# Altium project PCB_Project.PrjPcb
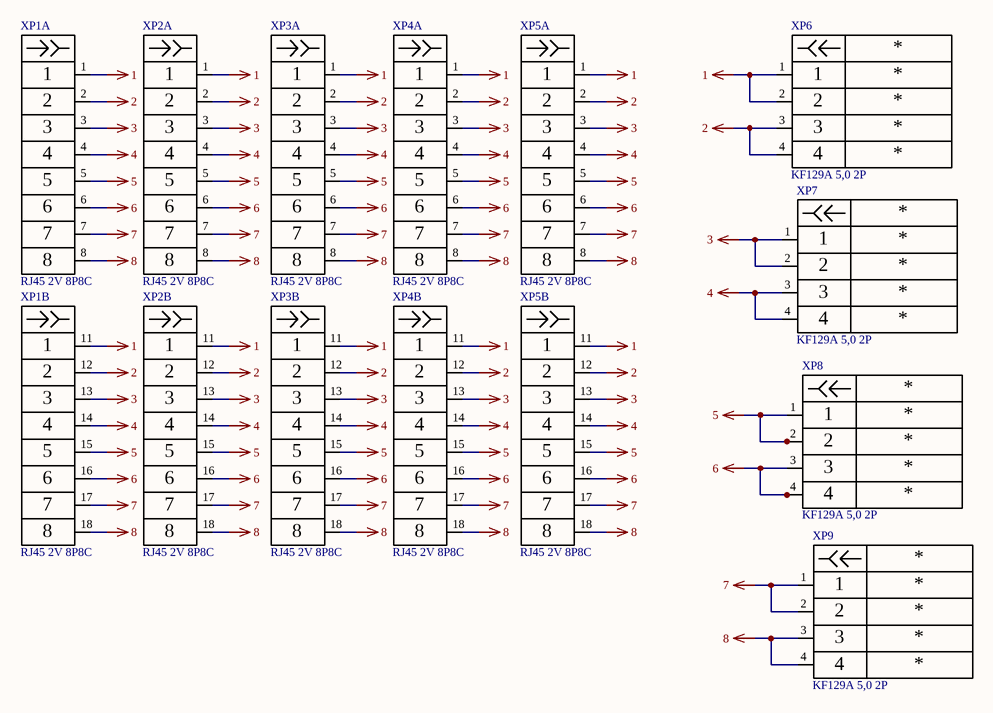
[diagram p0: Sheet3.SchDoc]
1 sheet, 9 parts. Net scope: global (net labels, ports and power ports of the same name join across sheets).
Board file: PCB2.PcbDoc

## Sheet Sheet3.SchDoc
size 420 x 297 mm; Razrabotal: {Разработал}; Prov: {Проверил}; Tkont: {Т. конт.}; Nkont: {Н. конт.}; Utv: {Утвердил}; Naimenovanie: {Наименование}; Oboznachenie: {Обозначение}; Shifr: {Шифр}

### Parts
XP1  RJ45 2V 8P8C  [RJ45 2V 8P8C]  (parts A,B of 2)
XP2  RJ45 2V 8P8C  [RJ45 2V 8P8C]  (parts A,B of 2)
XP3  RJ45 2V 8P8C  [RJ45 2V 8P8C]  (parts A,B of 2)
XP4  RJ45 2V 8P8C  [RJ45 2V 8P8C]  (parts A,B of 2)
XP5  RJ45 2V 8P8C  [RJ45 2V 8P8C]  (parts A,B of 2)
XP6  KF129A 5,0 2P  [KF129A 5,0 2P]
XP7  KF129A 5,0 2P  [KF129A 5,0 2P]
XP8  KF129A 5,0 2P  [KF129A 5,0 2P]
XP9  KF129A 5,0 2P  [KF129A 5,0 2P]

### Nets
1: XP1.1 XP1.11 XP2.1 XP2.11 XP3.1 XP3.11 XP4.1 XP4.11 XP5.1 XP5.11 XP6.1 XP6.2
2: XP1.2 XP1.12 XP2.2 XP2.12 XP3.2 XP3.12 XP4.2 XP4.12 XP5.2 XP5.12 XP6.3 XP6.4
3: XP1.3 XP1.13 XP2.3 XP2.13 XP3.3 XP3.13 XP4.3 XP4.13 XP5.3 XP5.13 XP7.1 XP7.2
4: XP1.4 XP1.14 XP2.4 XP2.14 XP3.4 XP3.14 XP4.4 XP4.14 XP5.4 XP5.14 XP7.3 XP7.4
5: XP1.5 XP1.15 XP2.5 XP2.15 XP3.5 XP3.15 XP4.5 XP4.15 XP5.5 XP5.15 XP8.1 XP8.2
6: XP1.6 XP1.16 XP2.6 XP2.16 XP3.6 XP3.16 XP4.6 XP4.16 XP5.6 XP5.16 XP8.3 XP8.4
7: XP1.7 XP1.17 XP2.7 XP2.17 XP3.7 XP3.17 XP4.7 XP4.17 XP5.7 XP5.17 XP9.1 XP9.2
8: XP1.8 XP1.18 XP2.8 XP2.18 XP3.8 XP3.18 XP4.8 XP4.18 XP5.8 XP5.18 XP9.3 XP9.4

### Notes on the sheet
- Перв. примен.
- Спра. №
- Подп. и дата
- Инв. № бубл.
- Взам. инв. №
- Изм
- Лист
- № докум.
- Подпись
- Дата
- Лит.
- Масса
- Масштаб
- Т. контр.
- Разраб.
- Пров.
- Листов
- Инв. № подл.
- Н. контр.
- Утв.
- Копировал
- Формат А3

### Library data of the parts
XP1-XP5 = RJ45 2V 8P8C: Comments: *
XP6-XP9 = KF129A 5,0 2P: Comments: *; Name1: *; Name2: *; Name3: *; Name: *; Name4: *